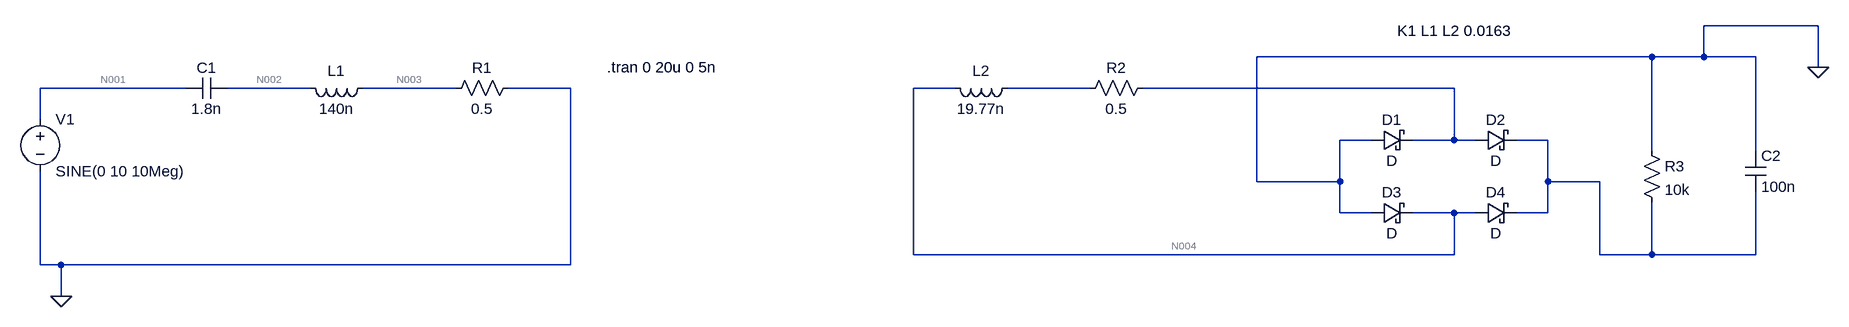
[diagram p0: schematic w_rectifier_initial_ckt_wpt_tx_rx_.asc]
w_rectifier_initial_ckt_wpt_tx_rx_.asc, the LTspice schematic file:
Version 4.1
SHEET 1 2756 680
WIRE 2736 -32 2560 -32
WIRE 2480 16 1872 16
WIRE 2560 16 2560 -32
WIRE 2560 16 2480 16
WIRE 2640 16 2560 16
WIRE 2736 32 2736 -32
WIRE 224 64 0 64
WIRE 416 64 288 64
WIRE 640 64 496 64
WIRE 816 64 720 64
WIRE 1408 64 1344 64
WIRE 1616 64 1488 64
WIRE 2176 64 1696 64
WIRE 0 112 0 64
WIRE 2048 144 2000 144
WIRE 2176 144 2176 64
WIRE 2176 144 2112 144
WIRE 2208 144 2176 144
WIRE 2320 144 2272 144
WIRE 2480 160 2480 16
WIRE 2640 160 2640 16
WIRE 1872 208 1872 16
WIRE 2000 208 2000 144
WIRE 2000 208 1872 208
WIRE 2320 208 2320 144
WIRE 2400 208 2320 208
WIRE 2000 256 2000 208
WIRE 2048 256 2000 256
WIRE 2176 256 2112 256
WIRE 2208 256 2176 256
WIRE 2320 256 2320 208
WIRE 2320 256 2272 256
WIRE 1344 320 1344 64
WIRE 2176 320 2176 256
WIRE 2176 320 1344 320
WIRE 2400 320 2400 208
WIRE 2480 320 2480 240
WIRE 2480 320 2400 320
WIRE 2640 320 2640 224
WIRE 2640 320 2480 320
WIRE 0 336 0 192
WIRE 32 336 0 336
WIRE 816 336 816 64
WIRE 816 336 32 336
WIRE 32 384 32 336
FLAG 32 384 0
FLAG 2736 32 0
SYMBOL voltage 0 96 R0
WINDOW 123 24 124 Left 2
WINDOW 39 0 0 Left 0
SYMATTR InstName V1
SYMATTR Value SINE(0 10 10Meg)
SYMBOL cap 288 48 R90
WINDOW 0 0 32 VBottom 2
WINDOW 3 32 32 VTop 2
SYMATTR InstName C1
SYMATTR Value 1.8n
SYMBOL ind 512 48 R90
WINDOW 0 5 56 VBottom 2
WINDOW 3 32 56 VTop 2
SYMATTR InstName L1
SYMATTR Value 140n
SYMATTR Type ind
SYMBOL res 736 48 R90
WINDOW 0 0 56 VBottom 2
WINDOW 3 32 56 VTop 2
SYMATTR InstName R1
SYMATTR Value 0.5
SYMBOL ind 1504 48 R90
WINDOW 0 5 56 VBottom 2
WINDOW 3 32 56 VTop 2
SYMATTR InstName L2
SYMATTR Value 19.77n
SYMATTR Type ind
SYMBOL res 1712 48 R90
WINDOW 0 0 56 VBottom 2
WINDOW 3 32 56 VTop 2
SYMATTR InstName R2
SYMATTR Value 0.5
SYMBOL schottky 2048 160 R270
WINDOW 0 32 32 VTop 2
WINDOW 3 0 32 VBottom 2
SYMATTR InstName D1
SYMBOL schottky 2208 160 R270
WINDOW 0 32 32 VTop 2
WINDOW 3 0 32 VBottom 2
SYMATTR InstName D2
SYMBOL schottky 2048 272 R270
WINDOW 0 32 32 VTop 2
WINDOW 3 0 32 VBottom 2
SYMATTR InstName D3
SYMBOL schottky 2208 272 R270
WINDOW 0 32 32 VTop 2
WINDOW 3 0 32 VBottom 2
SYMATTR InstName D4
SYMBOL res 2464 144 R0
SYMATTR InstName R3
SYMATTR Value 10k
SYMBOL cap 2624 160 R0
SYMATTR InstName C2
SYMATTR Value 100n
TEXT 2088 -24 Left 2 !K1 L1 L2 0.0163
TEXT 872 32 Left 2 !.tran 0 20u 0 5n

The netlist it stands for:
* w_rectifier_initial_ckt_wpt_tx_rx_.asc
V1 N001 0 SINE(0 10 10Meg)
C1 N002 N001 1.8n
L1 N003 N002 140n
R1 0 N003 0.5
L2 N005 N004 19.77n
R2 N006 N005 0.5
D1 0 N006 D
D2 N006 N007 D
D3 0 N004 D
D4 N004 N007 D
R3 0 N007 10k
C2 0 N007 100n
.model D D
.lib standard.dio
K1 L1 L2 0.0163
.tran 0 20u 0 5n
.backanno
.end

* Results of the author's LTspice run, read from the files saved beside the schematic
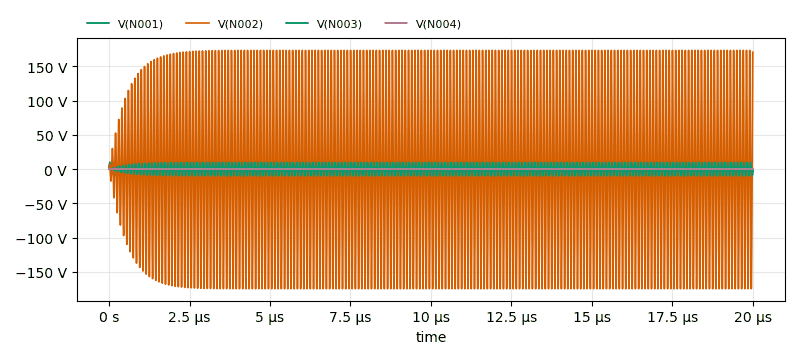
[diagram p1: Transient Analysis of w_rectifier_initial_ckt_wpt_tx_rx_.asc, plotted from the saved traces]
* Transient Analysis, 1 run:
*   V(N001): min -9.992 V, max 10 V, average 457 µV, rms 7.083 V, last 0 V
*   V(N002): min -174.8 V, max 173.4 V, average -30.3 mV, rms 121 V, last 170.7 V
*   V(N003): min -9.857 V, max 9.83 V, average -7.682 mV, rms 6.835 V, last -1.615 V
*   V(N004): min -535 mV, max 531.2 mV, average -312.7 nV, rms 369.9 mV, last 527.9 mV